# Altium schematic sheet 2EDL23.SchDoc
size A3; SheetNumber: 3; SheetTotal: 3
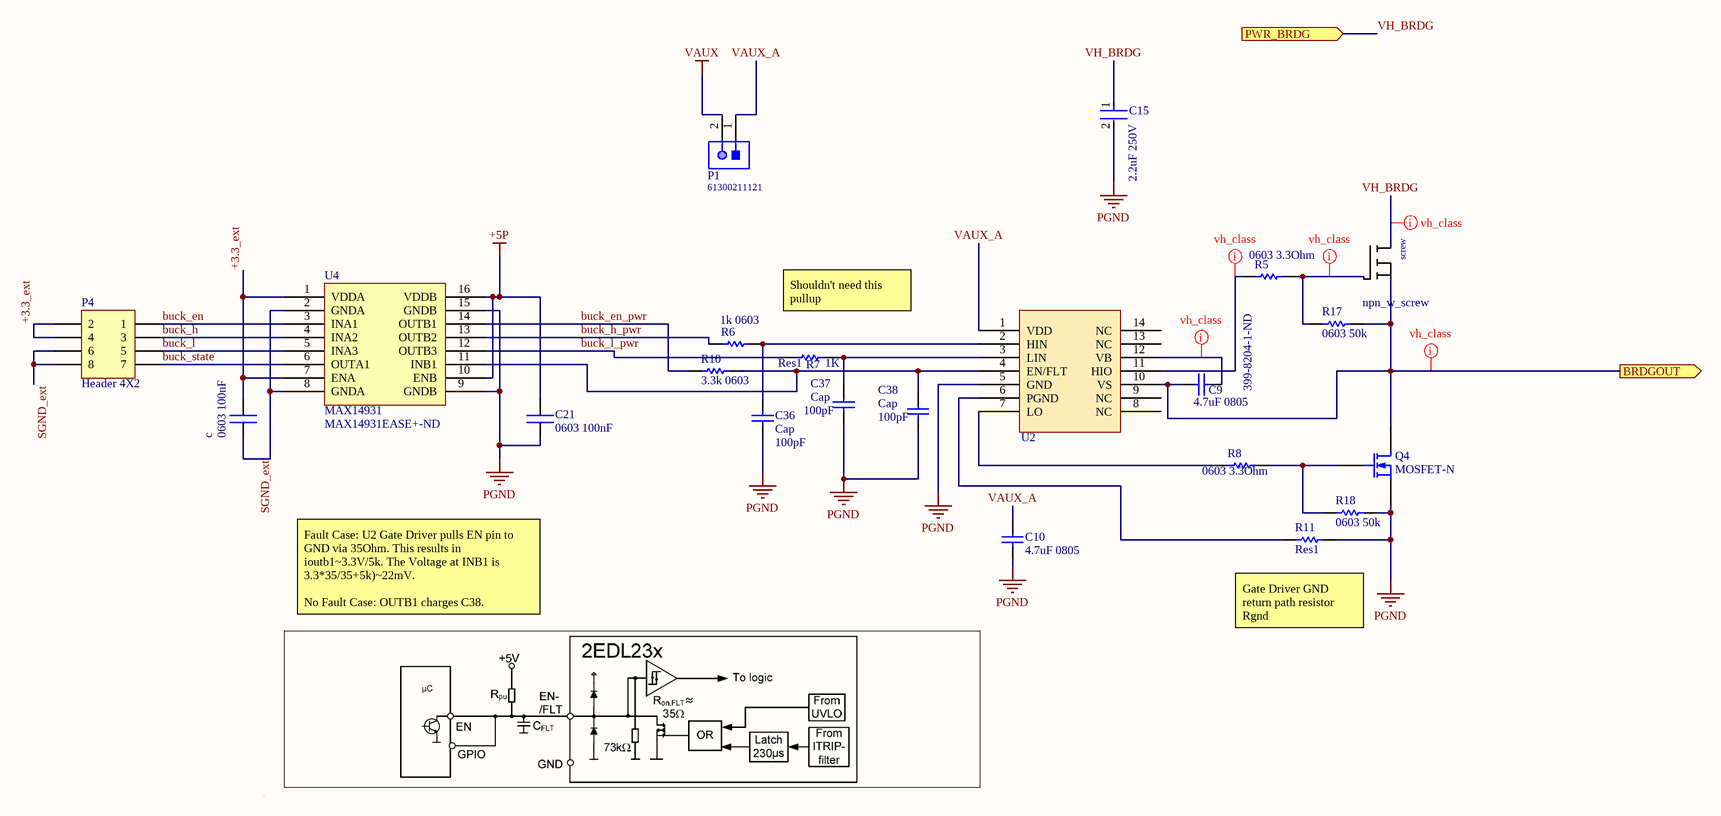
[diagram p0: 2EDL23.SchDoc]

## Parts
c  0603 100nF  [CAP 0603_1608]
C9  4.7uF 0805  Supplier Part Number 1: 399-8204-1-ND  [CAP 1206_3216 - 0.8MM]
C10  4.7uF 0805  [CAP 0805_2012]
C15  2.2uF 250V  [FP-CGA9P-IPC_B]
C21  0603 100nF  [CAP 0603_1608]
C36  Cap  value 100pF  [CAP 0603_1608]
C37  Cap  value 100pF  [CAP 0603_1608]
C38  Cap  value 100pF  [CAP 0603_1608]
P1  61300211121  [61300211121]
P4  Header 4X2  [HEADER_4_2]
Q3  npn_w_screw  [TO-220_3_bent]
Q4  MOSFET-N  [TO-220_3_bent]
R5  0603 3.3Ohm  [RES 1206_3216]
R6  1k 0603  [RES 0603_1608]
R7  Res1  value 1K  [RES 0603_1608]
R8  0603 3.3Ohm  [RES 1206_3216]
R10  3.3k 0603  [RES 0603_1608]
R11  Res1  [RES 0805_2012]
R17  0603 50k  [RES 0603_1608]
R18  0603 50k  [RES 0603_1608]
U2  -  [2EDL23I06PJ]  (value not drawn)
U4  MAX14931  Supplier Part Number 1: MAX14931EASE+-ND  [SOP16_narrow]

## Ports
BRDGOUT (out), PWR_BRDG (in)

## Nets
+5P: C21.1 U4.10(ENB) U4.16(VDDB)
PGND: C10.1 C15.2 C21.2 C36.1 C37.1 C38.1 Q4.3(S) R11.2 R18.2 U2.5(GND) U4.9(GNDB) U4.15(GNDB)
VAUX: P1.2
+3.3_ext: c.1 P4.2 P4.4 U4.1(VDDA) U4.7(ENA)
BRDGOUT: C9.1 Q3.3 Q4.1(D) R17.2 U2.10(VS) ; port BRDGOUT
buck_en: P4.1 U4.3(INA1)
buck_en_pwr: R10.2 U4.14(OUTB1)
buck_h: P4.3 U4.4(INA2)
buck_h_pwr: R6.1 U4.13(OUTB2)
buck_l: P4.5 U4.5(INA3)
buck_l_pwr: R7.1 U4.12(OUTB3)
buck_state: P4.7 U4.6(OUTA1)
SGND_ext: c.2 P4.6 P4.8 U4.2(GNDA) U4.8(GNDA)
VAUX_A: C10.2 P1.1 U2.1(VDD)
VH_BRDG: C15.1 Q3.1 ; port PWR_BRDG
NetC9_2: C9.2 U2.12(VB)
NetC36_2: C36.2 R6.2 U2.2(HIN)
NetC37_2: C37.2 R7.2 U2.3(LIN)
NetC38_2: C38.2 R10.1 U2.4(EN/FLT) U4.11(INB1)
NetQ3_2: Q3.2 R5.2 R17.1
NetQ4_2: Q4.2(G) R8.2 R18.1
NetR5_1: R5.1 U2.11(HIO)
NetR8_1: R8.1 U2.7(LO)
NetR11_1: R11.1 U2.6(PGND)

Not connected (* = marked no-connect by the designer): Q3 4(screw); U2 8(NC) 9(NC) 13(NC) 14(NC)

## Layout directives
net class VH: BRDGOUT, NetC9_2, NetQ3_2, NetR5_1, VH_BRDG

## Notes on the sheet
- Shouldn't need this pullup
- Fault Case: U2 Gate Driver pulls EN pin to GND via 35Ohm. This results in ioutb1~3.3V/5k. The Voltage at INB1 is 3.3*35/35+5k)~22mV.
  No Fault Case: OUTB1 charges C38.
- (near R11) Gate Driver GND return path resistor Rgnd
- 1
- 2
- 3
- 4
- 5
- 6
- 7
- 8
- A
- B
- C
- D
- Project:
- Date:
- Drawing number:
- Rev:
- Format:
- A3
- Drawn by:
- Laboratory:
- Page
- Sheet:
- of
- File:

## Library data of the parts
c C21 = cap_smd: Supplier 1: Digi-Key; Supplier Part Number 1: 445-5666-1-ND
C9 C10 C36-C38 = Cap: Capacitor; Published: 8-Jun-2000; LatestRevisionDate: 17-Jul-2002; LatestRevisionNote: Re-released for DXP Platform.; PackageReference: RAD-0.3; Publisher: Altium Limited; PackageDescription: Radial Cap, Thru-Hole; 2 Leads; 0.3 in Pin Spacing
  C9: Supplier 1: Digi-Key
C15 = CMP-08246-001668-1: Cap Ceramic 2.2uF 250V X7T 20% Pad SMD 2220 +125°C Automotive T/R / CGA9P3X7T2E225M250KE; Weight: 0.016932oz; Width: 0.197inch; Depth: 5mm; Termination: SMD/SMT; Capacitance: 2.2uF; Voltage Rating (DC): 250V; Dielectric: X7T; Case/Package: 2220; Package Quantity: 500; Height: 2.5mm; Min Operating Temperature: -55°C; Case Code (Metric): 5750; Features: Soft Termination; Max Operating Temperature: 125°C; Ratings: AEC-Q200; Thickness: 0.098inch; Length: 5.7mm; Mount: Surface Mount; Tolerance: 20%; Voltage Rating: 250V; Case Code (Imperial): 2220; Packaging: Tape and Reel
P1 = CMP-1712-00002-4: THT Vertical Pin Header WR-PHD, Pitch 2.54 mm, Single Row, 2 pins; Manufacturer: Wurth Elektronik; Rated Current: 3A; Gender: Male; Withstanding Voltage: 500VAC; Working Voltage: 250VAC; Pitch: 2.54mm; Contact Resistance: 20mOhm; Pin Number: 2; Mounting Technology: THT; Orientation: Vertical; Operating Temperature: -40to105degC; Packaging: Bag; Publisher: WurthElektronik; Datasheet URL: https://katalog.we-online.de/em/datasheet/6130xx11121.pdf; Manufacturer URL: http://www.we-online.de; Row Number: Single; Package Reference: 61300211121; Part Number: 61300211121
P4 = Header 4X2: Header, 4-Pin, Dual row; System: Connector; LatestRevisionDate: 17-Jul-2002; LatestRevisionNote: Re-released for DXP Platform.; Publisher: Altium Limited
Q4 = MOSFET-N: N-Channel MOSFET; Published: 8-Jun-2000; LatestRevisionDate: 17-Jul-2002; LatestRevisionNote: Re-released for DXP Platform.; PackageVersion: 1995/1996; PackageReference: E3; Publisher: Altium Limited; PackageDescription: TO, Flat Index; 3 In-Line, Axial Leads; Body Dia. 4.6mm; Lead Dia. 0.5 mm (max)
R5 R8 R10 R11 = Res1: Resistor; Value: 1K; Published: 8-Jun-2000; LatestRevisionDate: 17-Jul-2002; LatestRevisionNote: Re-released for DXP Platform.; PackageReference: AXIAL-0.3; Publisher: Altium Limited; PackageDescription: Axial Device, Thru-Hole; 2 Leads; 0.3 in Pin Spacing
R6 R7 = Res1: Resistor; Published: 8-Jun-2000; LatestRevisionDate: 17-Jul-2002; LatestRevisionNote: Re-released for DXP Platform.; PackageReference: AXIAL-0.3; Publisher: Altium Limited; PackageDescription: Axial Device, Thru-Hole; 2 Leads; 0.3 in Pin Spacing
  R6: Value: 1K
R17 R18 = Res1: Value: 1K; Published: 8-Jun-2000; LatestRevisionDate: 17-Jul-2002; LatestRevisionNote: Re-released for DXP Platform.; PackageReference: AXIAL-0.3; Publisher: Altium Limited; PackageDescription: Axial Device, Thru-Hole; 2 Leads; 0.3 in Pin Spacing
U2 = 2EDL23I06PJ: Supplier 1: Digi-Key; Supplier Part Number 1: 2EDL23N06PJXUMA1CT-ND
U4 = MAX14931: Supplier 1: Digi-Key